# EAGLE design e-Tapperhandpiece13 (EAGLE 8.2.2)
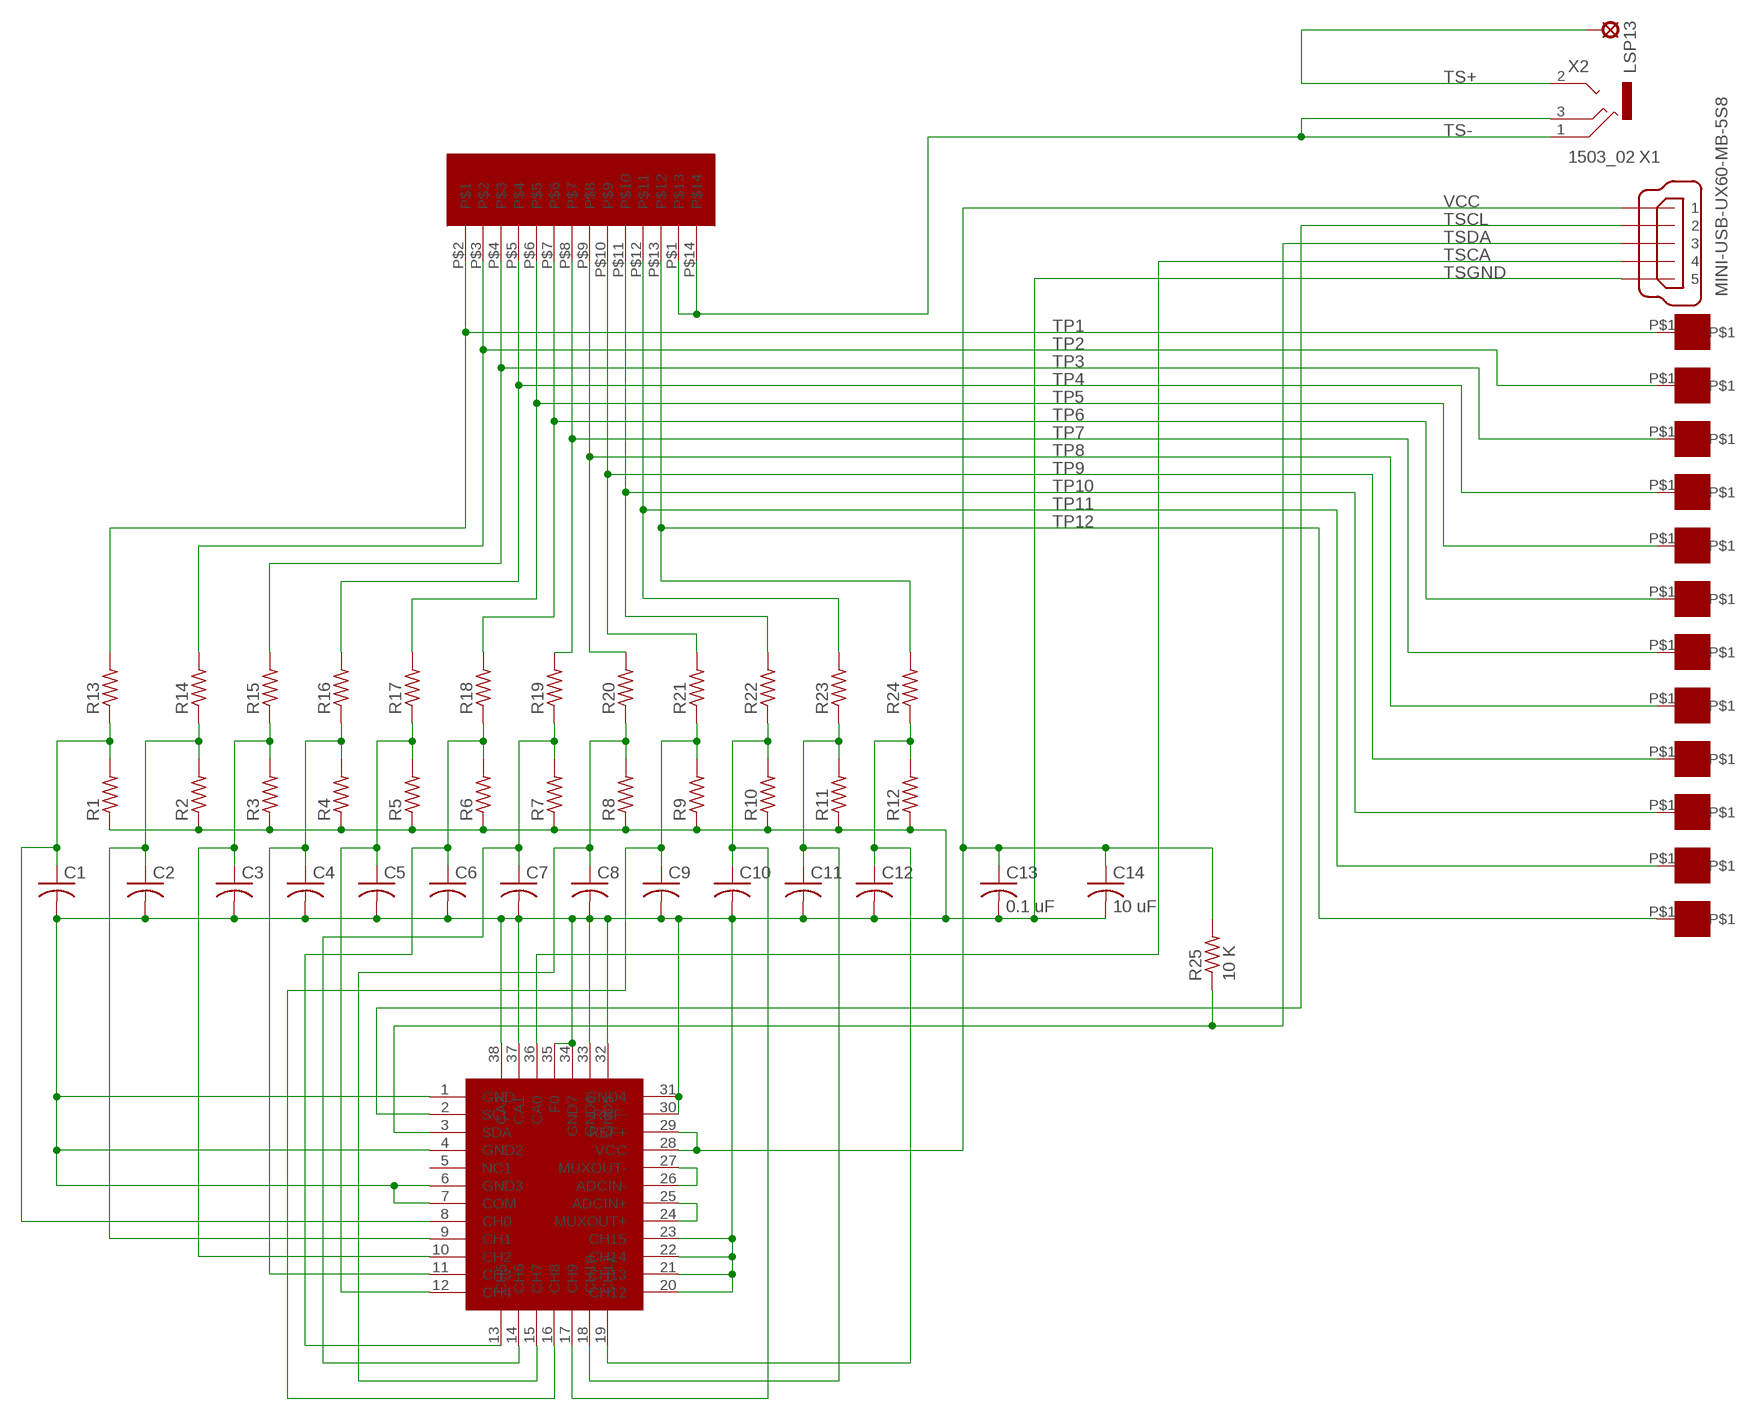
[diagram p0: schematic, sheet 1]

## Parts
C1  C-USC0603  [C0603]
C2  C-USC0603  [C0603]
C3  C-USC0603  [C0603]
C4  C-USC0603  [C0603]
C5  C-USC0603  [C0603]
C6  C-USC0603  [C0603]
C7  C-USC0603  [C0603]
C8  C-USC0603  [C0603]
C9  C-USC0603  [C0603]
C10  C-USC0603  [C0603]
C11  C-USC0603  [C0603]
C12  C-USC0603  [C0603]
C13  0.1 uF  C-USC0603  [C0603]
C14  10 uF  C-USC0805  [C0805]
LSP13  SE11  [SE11]
R1  R-US_R0402  [R0402]
R2  R-US_R0402  [R0402]
R3  R-US_R0402  [R0402]
R4  R-US_R0402  [R0402]
R5  R-US_R0402  [R0402]
R6  R-US_R0402  [R0402]
R7  R-US_R0402  [R0402]
R8  R-US_R0402  [R0402]
R9  R-US_R0402  [R0402]
R10  R-US_R0402  [R0402]
R11  R-US_R0402  [R0402]
R12  R-US_R0402  [R0402]
R13  R-US_R0402  [R0402]
R14  R-US_R0402  [R0402]
R15  R-US_R0402  [R0402]
R16  R-US_R0402  [R0402]
R17  R-US_R0402  [R0402]
R18  R-US_R0402  [R0402]
R19  R-US_R0402  [R0402]
R20  R-US_R0402  [R0402]
R21  R-US_R0402  [R0402]
R22  R-US_R0402  [R0402]
R23  R-US_R0402  [R0402]
R24  R-US_R0402  [R0402]
R25  10 K  R-US_R0402  [R0402]
TSP1  ET1  [ET1]
TSP2  ET1  [ET1]
TSP3  ET1  [ET1]
TSP4  ET1  [ET1]
TSP5  ET1  [ET1]
TSP6  ET1  [ET1]
TSP7  ET1  [ET1]
TSP8  ET1  [ET1]
TSP9  ET1  [ET1]
TSP10  ET1  [ET1]
TSP11  ET1  [ET1]
TSP12  ET1  [ET1]
U$1  LTC2497  [QFN38-5X7]
U$2  SS112D01  [SS112D01]
X1  MINI-USB-UX60-MB-5S8  [UX60-MB-5S8]
X2  1503_02  [1503_02]

## Nets
N$1: C9.1 R9.2 R21.1 U$1.16(CH8)
N$2: U$1.26(ADCIN-) U$1.27(MUXOUT-)
N$3: U$1.24(MUXOUT+) U$1.25(ADCIN+)
N$5: C12.1 R12.2 R24.1 U$1.19(CH11)
N$7: C4.1 R4.2 R16.1 U$1.11(CH3)
N$8: C10.1 R10.2 R22.1 U$1.17(CH9)
N$9: C8.1 R8.2 R20.1 U$1.15(CH7)
N$18: C5.1 R5.2 R17.1 U$1.12(CH4)
N$19: C6.1 R6.2 R18.1 U$1.13(CH5)
N$20: C7.1 R7.2 R19.1 U$1.14(CH6)
N$22: C3.1 R3.2 R15.1 U$1.10(CH2)
N$23: C2.1 R2.2 R14.1 U$1.9(CH1)
N$24: C11.1 R11.2 R23.1 U$1.18(CH10)
N$25: C1.1 R1.2 R13.1 U$1.8(CH0)
TP1: R13.2 TSP1.P$1 U$2.P$2
TP2: R14.2 TSP2.P$1 U$2.P$3
TP3: R15.2 TSP3.P$1 U$2.P$4
TP4: R16.2 TSP4.P$1 U$2.P$5
TP5: R17.2 TSP5.P$1 U$2.P$6
TP6: R18.2 TSP6.P$1 U$2.P$7
TP7: R19.2 TSP7.P$1 U$2.P$8
TP8: R20.2 TSP8.P$1 U$2.P$9
TP9: R21.2 TSP9.P$1 U$2.P$10
TP10: R22.2 TSP10.P$1 U$2.P$11
TP11: R23.2 TSP11.P$1 U$2.P$12
TP12: R24.2 TSP12.P$1 U$2.P$13
TS+: LSP13.MP X2.2
TS-: U$2.P$1 U$2.P$14 X2.1 X2.3
TSCA: U$1.36(CA0) X1.4
TSCL: U$1.2(SCL) X1.2
TSDA: R25.1 U$1.3(SDA) X1.3
TSGND: C1.2 C2.2 C3.2 C4.2 C5.2 C6.2 C7.2 C8.2 C9.2 C10.2 C11.2 C12.2 C13.2 C14.2 R1.1 R2.1 R3.1 R4.1 R5.1 R6.1 R7.1 R8.1 R9.1 R10.1 R11.1 R12.1 U$1.1(GND) U$1.4(GND2) U$1.6(GND3) U$1.7(COM) U$1.20(CH12) U$1.21(CH13) U$1.22(CH14) U$1.23(CH15) U$1.30(REF-) U$1.31(GND4) U$1.32(GND5) U$1.33(GND6) U$1.34(GND7) U$1.35(F0) U$1.37(CA1) U$1.38(CA2) X1.5
VCC: C13.1 C14.1 R25.2 U$1.28(VCC) U$1.29(REF+) X1.1
Unconnected: U$1.5(NC1) X2.2@2

## Library data of the parts
C1-C14 = rcl:C-US: CAPACITOR, American symbol
LSP13 = solpad:SE11: SOLDER PAD RTM, drill 1,1mm, distributor Buerklin, 07F810
R1-R25 = resistor:R-US_: RESISTOR, American symbol
TSP1-TSP12 = ET1:ET1: Through Hold Pads 20 mil drill hole
U$1 = LTC2497:LTC2497: LTC2497 16 Channel ADC with I2C interface
U$2 = SS112D01:SS112D01
X1 = con-hirose:MINI-USB-: MINI USB Connector Source: http://www.hirose.co.jp/cataloge_hp/e24000019.pdf; OC_FARNELL: unknown; OC_NEWARK: unknown
X2 = con-lumberg:1503_02: Jack connectors according to JISC 6560, 3.5 mm Klinkeneinbaukupplung nach JISC 6560, 3,5 mm, 3-polig/stereo, abgewinkelte Ausführung, Surface-Mount-Technik (SMT) Source: http://www.lumberg.com/Produkte/PDFs/1503_02.pdf; OC_FARNELL: 1216979; OC_NEWARK: unknown

## Net classes
0 default: clearance 0.205 mm

## Board
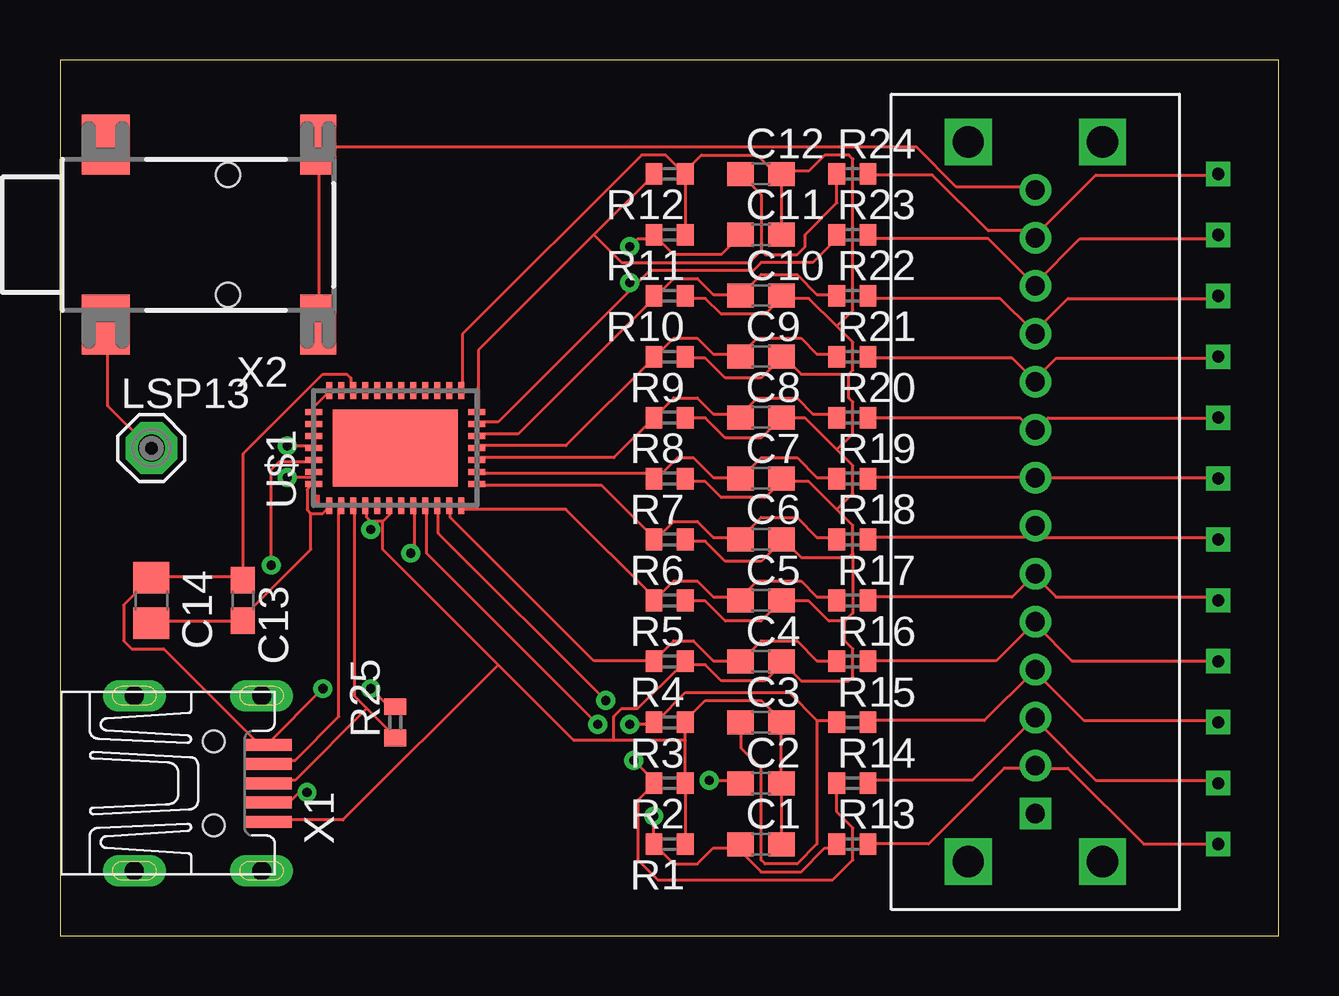
[diagram p1: board, top side]
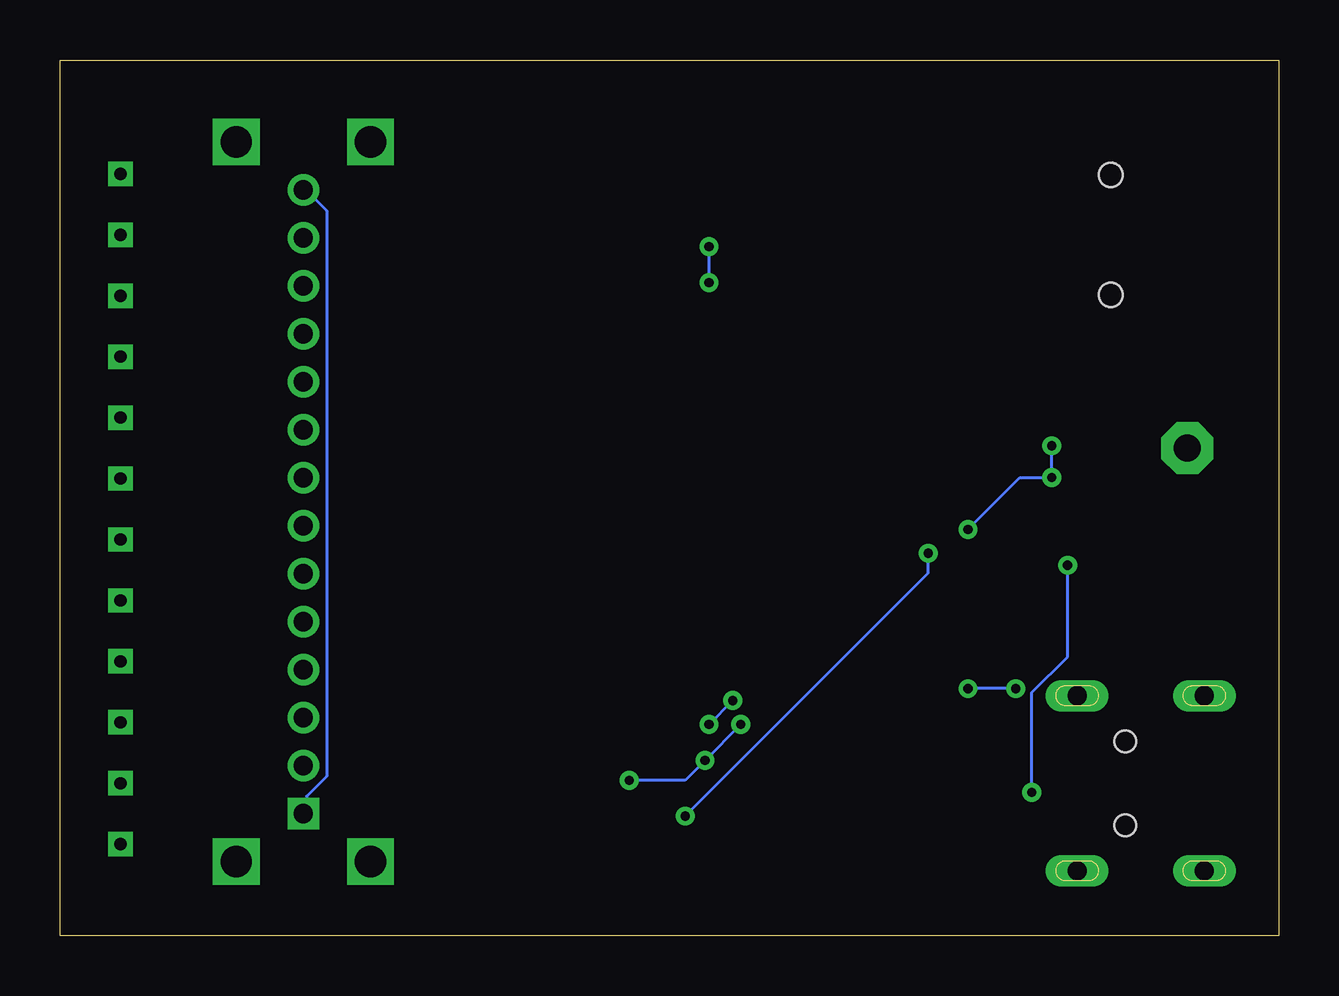
[diagram p2: board, bottom side, seen from below]

Size 50.78 x 36.5 mm. Coordinates in mm from the lower left corner, seen from the top.
Outline: 0,0 50.78,0 50.78,36.5 0,36.5 0,0
Copper layers (1*16): Top 0.035mm / dielectric 1.5mm / Bottom 0.035mm
Design rules "default *": minimum track width 5mil, minimum drill 15mil, track to track 6mil, track to pad 6mil, pad to pad 6mil, via to via 6mil, smd to smd 6mil, copper to edge 6mil, drill to drill 6mil, minimum pad ring 10mil, minimum via ring 8mil, stop-mask expansion 4mil, vias tented up to drill 0mil, thermal gap 10mil

### Footprints (pad centres in the part's own frame; a part is rotated, then mirrored left to right if it is on the bottom)
C0603 = smd 1.1 x 1: 1 -0.85,0; 2 0.85,0
C0805 = smd 1.3 x 1.5: 1 -0.95,0; 2 0.95,0
SE11 = drill 1.118 pad 2.159 octagon: MP 0,0
R0402 = smd 0.7 x 0.9: 1 -0.65,0; 2 0.65,0
ET1 = drill 0.508 square: P$1 0,0
QFN38-5X7 = smd 0.7 x 0.25: 1 -2.4,2.75; 2 -2.4,2.25; 3 -2.4,1.75; 4 -2.4,1.25; 5 -2.4,0.75; 6 -2.4,0.25; 7 -2.4,-0.25; 8 -2.4,-0.75; 9 -2.4,-1.25; 10 -2.4,-1.75; 11 -2.4,-2.25; 12 -2.4,-2.75; 20 2.4,-2.75; 21 2.4,-2.25; 22 2.4,-1.75; 23 2.4,-1.25; 24 2.4,-0.75; 25 2.4,-0.25; 26 2.4,0.25; 27 2.4,0.75; 28 2.4,1.25; 29 2.4,1.75; 30 2.4,2.25; 31 2.4,2.75 | smd 0.25 x 0.7: 13 -1.5,-3.4; 14 -1,-3.4; 15 -0.5,-3.4; 16 0,-3.4; 17 0.5,-3.4; 18 1,-3.4; 19 1.5,-3.4; 32 1.5,3.4; 33 1,3.4; 34 0.5,3.4; 35 0,3.4; 36 -0.5,3.4; 37 -1,3.4; 38 -1.5,3.4 | smd 3.2 x 5.2: EXP 0,0
SS112D01 = drill 0.8 square: P$1 6.35,3.81 | drill 0.8: P$2 6.35,5.81; P$3 6.35,7.81; P$4 6.35,9.81; P$5 6.35,11.81; P$6 6.35,13.81; P$7 6.35,15.81; P$8 6.35,17.81; P$9 6.35,19.81; P$10 6.35,21.81; P$11 6.35,23.81; P$12 6.35,25.81; P$13 6.35,27.81; P$14 6.35,29.81 | drill 1.3 square: P$15 9.15,31.81; P$16 3.55,31.81; P$17 9.15,1.81; P$18 3.55,1.81
UX60-MB-5S8 = smd 2 x 0.5: 1 8.65,1.6; 2 8.65,0.8; 3 8.65,0; 4 8.65,-0.8; 5 8.65,-1.6 | drill 0.8 long: M1 3.1,-3.65; M2 3.1,3.65; M3 8.4,3.65; M4 8.4,-3.65 | hole 0.9: 6.4,-1.75; 6.4,1.75
1503_02 = smd 2.5 x 1.5: 1 -3.75,-10.75; 3 3.75,-10.75 | smd 2.5 x 2: 2 -3.75,-1.9; 2@2 3.75,-1.9 | hole 1: -2.5,-7; 2.5,-7

### Placement (x,y rotation side)
C1  29.21,3.81 0 top
C2  29.21,6.35 0 top
C3  29.21,8.89 0 top
C4  29.21,11.43 0 top
C5  29.21,13.97 0 top
C6  29.21,16.51 0 top
C7  29.21,19.05 0 top
C8  29.21,21.59 0 top
C9  29.21,24.13 0 top
C10  29.21,26.67 0 top
C11  29.21,29.21 0 top
C12  29.21,31.75 0 top
C13  7.62,13.97 270 top
C14  3.81,13.97 270 top
LSP13  3.81,20.32 0 top
R1  25.4,3.81 180 top
R2  25.4,6.35 180 top
R3  25.4,8.89 180 top
R4  25.4,11.43 180 top
R5  25.4,13.97 180 top
R6  25.4,16.51 180 top
R7  25.4,19.05 180 top
R8  25.4,21.59 180 top
R9  25.4,24.13 180 top
R10  25.4,26.67 180 top
R11  25.4,29.21 180 top
R12  25.4,31.75 180 top
R13  33.02,3.81 0 top
R14  33.02,6.35 0 top
R15  33.02,8.89 0 top
R16  33.02,11.43 0 top
R17  33.02,13.97 0 top
R18  33.02,16.51 0 top
R19  33.02,19.05 0 top
R20  33.02,21.59 0 top
R21  33.02,24.13 0 top
R22  33.02,26.67 0 top
R23  33.02,29.21 0 top
R24  33.02,31.75 0 top
R25  13.97,8.89 90 top
TSP1  48.26,3.81 0 top
TSP2  48.26,6.35 0 top
TSP3  48.26,8.89 0 top
TSP4  48.26,11.43 0 top
TSP5  48.26,13.97 0 top
TSP6  48.26,16.51 0 top
TSP7  48.26,19.05 0 top
TSP8  48.26,21.59 0 top
TSP9  48.26,24.13 0 top
TSP10  48.26,26.67 0 top
TSP11  48.26,29.21 0 top
TSP12  48.26,31.75 0 top
U$1  13.97,20.32 90 top
U$2  34.29,1.27 0 top
X1  0,6.35 0 top
X2  0,29.21 90 top

### Tracks (layer width: path | path; a pad name or v marks a point on that pad's centre or on a via)
N$1
  Top 0.127: R21.1 32.37,24.24 31.54,24.24 30.88,24.9 29.05,24.9 28.39,24.24 C9.1 28.22,24.24 27.22,24.24 26.56,24.9 25.56,24.9 24.9,24.24 R9.2 24.73,24.07 21.08,20.42 17.43,20.42 U$1.16
N$2
  Top 0.127: U$1.27 13.28,22.74 13.61,22.74 U$1.26
N$3
  Top 0.127: U$1.25 14.28,22.74 14.61,22.74 U$1.24
N$5
  Top 0.127: R24.1 32.37,30.54 31.04,29.22 31.04,28.72 30.71,28.39 29.38,28.39 29.22,28.55 | 29.22,28.55 29.22,30.88 28.39,31.71 C12.1 | 22.24,29.22 24.73,31.71 R12.2 | 22.24,29.22 17.43,24.4 17.43,21.91 U$1.19 | 29.22,28.55 28.72,28.05 23.41,28.05 22.24,29.22
N$7
  Top 0.127: R16.1 32.37,11.45 31.54,11.45 30.71,12.28 29.22,12.28 28.39,11.45 C4.1 28.22,11.45 27.22,11.45 26.39,12.28 25.56,12.28 24.73,11.45 | 24.73,11.45 22.24,11.45 16.27,17.43 16.27,17.76 U$1.11 | 24.73,11.45 R4.2
N$8
  Top 0.127: R22.1 32.37,26.73 31.54,26.73 30.71,27.56 29.22,27.56 28.39,26.73 C10.1 28.22,26.73 27.22,26.73 26.56,27.39 25.56,27.39 24.9,26.73 R10.2 24.73,26.56 19.09,20.92 17.43,20.92 U$1.17
N$9
  Top 0.127: R20.1 32.37,21.75 31.37,21.75 30.71,22.41 29.05,22.41 28.39,21.75 C8.1 28.22,21.75 27.22,21.75 26.56,22.41 25.56,22.41 24.9,21.75 R8.2 24.73,21.58 23.07,19.92 17.43,19.92 U$1.15
N$18
  Top 0.127: R17.1 32.37,14.11 31.54,14.11 30.88,14.77 29.05,14.77 28.39,14.11 C5.1 28.22,14.11 27.22,14.11 26.56,14.77 25.56,14.77 24.9,14.11 R5.2 24.73,14.11 21.08,17.76 16.77,17.76 U$1.12
N$19
  Top 0.127: R18.1 32.37,16.6 31.54,16.6 30.71,17.43 29.22,17.43 28.39,16.6 C6.1 28.22,16.6 27.22,16.6 26.56,17.26 25.56,17.26 24.9,16.6 R6.2 24.73,16.6 22.58,18.76 17.43,18.76 U$1.13
N$20
  Top 0.127: R19.1 32.37,19.09 31.54,19.09 30.71,19.92 29.22,19.92 28.39,19.09 C7.1 28.22,19.09 27.22,19.09 26.39,19.92 25.73,19.92 24.9,19.09 R7.2 24.73,19.09 24.57,19.26 17.43,19.26 U$1.14
N$22  (via drill 0.38)
  Top 0.127: v22.74,9.79 15.77,16.77 15.77,17.76 U$1.10 | v23.74,8.8 24.73,8.8 R3.2 24.9,8.96 26.06,10.13 30.38,10.13 31.54,8.96 | 31.54,8.96 32.37,8.96 R15.1 | 31.54,8.96 31.54,3.82 30.71,2.99 29.38,2.99 29.22,3.15 29.22,6.97 28.39,7.8 28.39,8.8 C3.1
  Bottom 0.127: v23.74,8.8 v22.74,9.79
N$23  (via drill 0.38)
  Top 0.127: v22.41,8.8 15.27,15.94 15.27,17.76 U$1.9 | v23.9,7.3 24.73,6.47 R2.2 24.73,6.31 24.07,5.64 24.07,3.15 24.9,2.32 32.2,2.32 33.03,3.15 33.03,4.48 32.37,5.15 R14.1 | v27.06,6.47 28.22,6.47 C2.1
  Bottom 0.127: v22.41,8.8 v23.9,7.3 24.73,6.47 v27.06,6.47
N$24  (via drill 0.38)
  Top 0.127: C11.1 28.22,29.05 27.56,28.39 25.56,28.39 24.9,29.05 R11.2 24.73,29.05 24.07,29.05 v23.74,28.72 | 23.9,27.06 24.57,27.72 28.88,27.72 29.22,28.05 31.37,28.05 32.37,29.05 R23.1 | 23.9,27.06 18.26,21.41 17.43,21.41 U$1.18 | 23.9,27.06 v23.74,27.22
  Bottom 0.127: v23.74,27.22 v23.74,28.72
N$25  (via drill 0.38)
  Top 0.127: 28.22,3.65 29.22,2.66 30.88,2.66 31.87,3.65 32.37,3.65 R13.1 | v14.61,15.94 14.77,16.1 14.77,17.76 U$1.8 | v24.73,4.98 24.73,3.82 R1.2 24.9,3.65 25.56,2.99 26.56,2.99 27.22,3.65 28.22,3.65 | 28.22,3.65 C1.1
  Bottom 0.127: v14.61,15.94 14.61,15.11 v24.73,4.98
TP1
  Top 0.127: R13.2 33.7,3.82 36.19,3.82 39.34,6.97 40.5,6.97 U$2.P$2 40.67,6.97 42,6.97 45.15,3.82 48.14,3.82 TSP1.P$1
TP2
  Top 0.127: R14.2 33.7,6.47 38.01,6.47 40.5,8.96 U$2.P$3 40.67,8.96 43.16,6.47 48.14,6.47 TSP2.P$1
TP3
  Top 0.127: R15.2 33.7,8.96 38.51,8.96 40.5,10.96 U$2.P$4 40.67,10.96 42.66,8.96 48.14,8.96 TSP3.P$1
TP4
  Top 0.127: R16.2 33.7,11.45 39.01,11.45 40.5,12.95 U$2.P$5 40.67,12.95 42.16,11.45 48.14,11.45 TSP4.P$1
TP5
  Top 0.127: R17.2 33.7,14.11 39.67,14.11 40.5,14.94 U$2.P$6 40.67,14.94 41.5,14.11 48.14,14.11 TSP5.P$1
TP6
  Top 0.127: R18.2 33.7,16.6 40.17,16.6 40.5,16.93 U$2.P$7 40.67,16.93 41,16.6 48.14,16.6 TSP6.P$1
TP7
  Top 0.127: R19.2 33.7,19.09 40.5,19.09 U$2.P$8 40.67,19.09 48.14,19.09 TSP7.P$1
TP8
  Top 0.127: R20.2 33.7,21.58 40.01,21.58 40.5,21.08 U$2.P$9 40.67,21.08 41.17,21.58 48.14,21.58 TSP8.P$1
TP9
  Top 0.127: R21.2 33.7,24.07 39.67,24.07 40.5,23.24 U$2.P$10 40.67,23.24 41.5,24.07 48.14,24.07 TSP9.P$1
TP10
  Top 0.127: R22.2 33.7,26.56 39.18,26.56 40.5,25.23 U$2.P$11 40.67,25.23 42,26.56 48.14,26.56 TSP10.P$1
TP11
  Top 0.127: R23.2 33.7,29.05 38.68,29.05 40.5,27.22 U$2.P$12 40.67,27.22 42.5,29.05 48.14,29.05 TSP11.P$1
TP12
  Top 0.127: R24.2 33.7,31.71 36.35,31.71 38.68,29.38 40.34,29.38 U$2.P$13 40.67,29.22 43.16,31.71 48.14,31.71 TSP12.P$1
TS+
  Top 0.127: X2.2 1.99,25.4 1.99,22.08 3.65,20.42 LSP13.MP
TS-
  Top 0.127: 10.79,32.87 10.79,25.56 X2.1 | 10.79,32.87 35.69,32.87 37.35,31.21 40.5,31.21 U$2.P$14 | 10.79,32.87 X2.3
  Bottom 0.127: U$2.P$1 40.5,5.15 40.5,5.81 39.67,6.64 39.67,30.21 40.5,31.04 U$2.P$14
TSCA  (via drill 0.38)
  Top 0.127: v8.8,15.44 8.8,19.42 9.13,19.75 10.46,19.75 U$1.36 | v10.29,5.98 9.96,5.98 9.63,5.64 8.8,5.64 X1.4
  Bottom 0.127: v8.8,15.44 8.8,11.62 10.29,10.13 v10.29,5.98
TSCL
  Top 0.127: U$1.2 11.62,17.76 11.62,9.13 9.79,7.3 8.8,7.3 X1.2
TSDA
  Top 0.127: 12.78,9.46 13.94,8.3 R25.1 | 12.78,9.46 12.28,9.96 12.28,17.76 U$1.3 | 12.78,9.46 9.79,6.47 8.8,6.47 X1.3
TSGND  (via drill 0.38)
  Top 0.127: C11.2 30.05,29.22 30.05,31.71 C12.2 | U$1.23 15.27,22.74 15.6,22.74 U$1.22 15.77,22.74 16.1,22.74 U$1.21 16.27,22.74 16.6,22.74 U$1.20 16.77,22.74 16.77,25.07 24.24,32.54 25.23,32.54 25.9,31.87 R12.1 | R11.1 26.06,29.22 26.06,31.71 R12.1 | C12.2 30.05,31.87 29.71,31.87 29.05,32.54 26.73,32.54 26.06,31.87 R12.1 | R10.1 26.06,26.56 26.89,26.56 27.56,25.9 29.38,25.9 30.05,26.56 C10.2 30.21,26.56 31.21,26.56 32.37,25.4 | R9.1 26.06,24.07 26.89,24.07 27.72,23.24 29.22,23.24 30.05,24.07 C9.2 30.21,24.07 30.88,23.41 32.87,23.41 | 32.37,25.4 33.03,24.73 33.03,23.57 32.87,23.41 | R5.1 26.06,13.94 26.89,13.94 27.72,13.11 29.22,13.11 30.05,13.94 C5.2 30.21,13.94 31.21,13.94 32.04,13.11 32.7,13.11 | R8.1 26.06,21.58 26.89,21.58 27.72,20.75 29.22,20.75 30.05,21.58 C8.2 30.21,21.58 31.04,21.58 32.37,20.25 | R7.1 26.06,18.92 26.89,18.92 27.56,18.26 29.38,18.26 30.05,18.92 C7.2 30.21,18.92 31.21,18.92 32.37,17.76 | R6.1 26.06,16.43 26.89,16.43 27.72,15.6 29.22,15.6 30.05,16.43 C6.2 30.21,16.43 30.88,15.77 32.87,15.77 33.03,15.94 | 32.37,17.76 33.03,17.1 33.03,15.94 | 32.37,20.25 33.03,19.59 33.03,18.43 32.37,17.76 | 32.7,13.11 33.03,13.45 33.03,15.94 | 32.87,23.41 32.87,22.41 33.03,22.24 33.03,20.92 32.37,20.25 | U$1.30 11.62,22.74 11.29,22.74 U$1.31 11.12,22.58 10.46,21.91 U$1.32 10.62,21.75 10.62,21.41 U$1.33 10.62,21.25 10.62,20.92 U$1.34 10.62,20.75 10.62,20.42 U$1.35 10.46,20.42 v9.46,20.42 | 10.46,17.6 10.96,17.6 11.12,17.76 U$1.1 | 10.46,17.6 10.29,17.76 10.29,18.59 10.46,18.76 U$1.38 10.62,18.92 10.62,19.09 | 10.62,19.09 10.62,19.26 U$1.37
  Top 0.127: C14.2 3.82,13.11 7.47,13.11 C13.2 7.64,13.28 10.46,16.1 10.46,17.6 | 10.62,19.09 v9.46,19.09 | C1.2 30.05,3.82 30.05,6.31 C2.2 30.05,6.47 30.05,8.8 C3.2 30.05,8.96 29.22,9.79 26.89,9.79 26.06,8.96 R3.1 26.06,8.8 26.06,8.13 | 12.95,17.26 12.78,17.43 12.78,17.76 U$1.4 | 13.45,17.26 12.95,17.26 | 13.45,17.26 13.78,17.6 13.78,17.76 U$1.6 13.78,17.93 14.11,17.93 U$1.7 | R1.1 26.06,3.82 26.06,6.31 R2.1 26.06,6.47 26.06,8.13 | 13.45,17.26 13.45,16.1 18.26,11.29 | 18.26,11.29 21.41,8.13 23.07,8.13 | 26.06,8.13 23.07,8.13 | 18.26,11.29 11.79,4.81 8.8,4.81 X1.5 | 23.07,8.13 23.07,9.13 23.41,9.46 24.07,9.46 25.9,11.29 R4.1 26.06,11.29 26.89,11.29 27.56,10.62 29.38,10.62 30.05,11.29 C4.2 30.21,11.29 30.88,10.62 32.87,10.62 33.03,10.79 33.03,11.95 32.7,12.28 32.7,13.11 | 12.95,17.26 v12.95,16.93 | 32.37,25.4 33.03,26.06 33.03,32.37 32.87,32.54 31.87,32.54 31.21,31.87 30.21,31.87 C12.2
  Bottom 0.127: v9.46,20.42 v9.46,19.09 10.79,19.09 v12.95,16.93
VCC  (via drill 0.38)
  Top 0.127: v12.95,10.29 13.61,9.63 13.94,9.63 R25.2 | 8.63,7.97 v10.96,10.29 | U$1.28 12.62,22.74 12.28,22.74 U$1.29 12.12,22.74 12.12,23.24 11.95,23.41 10.96,23.41 7.64,20.09 7.64,14.94 C13.1 7.47,14.94 3.82,14.94 C14.1 3.65,14.77 2.66,13.78 2.66,12.28 2.99,11.95 4.32,11.95 8.3,7.97 8.63,7.97 | 8.63,7.97 X1.1
  Bottom 0.127: v10.96,10.29 v12.95,10.29